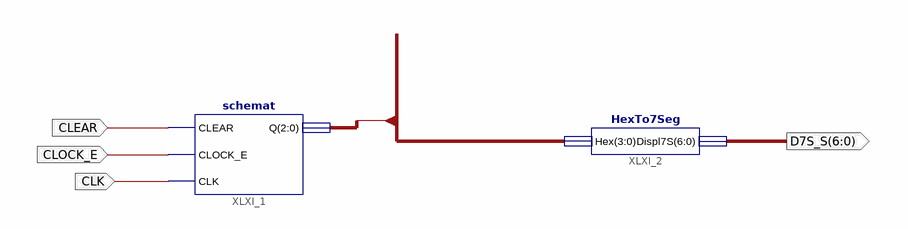
[diagram p0: schematic sheet 1]
// Xilinx ISE schematic zad2.sch (xc9500xl) as structural Verilog: 2 symbols, 4 ports
module zad2 (
  input  CLEAR,
  input  CLOCK_E,
  input  CLK,
  output [6:0] D7S_S
);

  wire [3:0] Q;

  schemat XLXI_1 (.CLEAR(CLEAR), .CLOCK_E(CLOCK_E), .CLK(CLK), .Q(Q[2:0]));
  HexTo7Seg XLXI_2 (.Hex(Q), .Displ7S(D7S_S));
endmodule
